# Altium schematic sheet FAT34.SchDoc
size A3
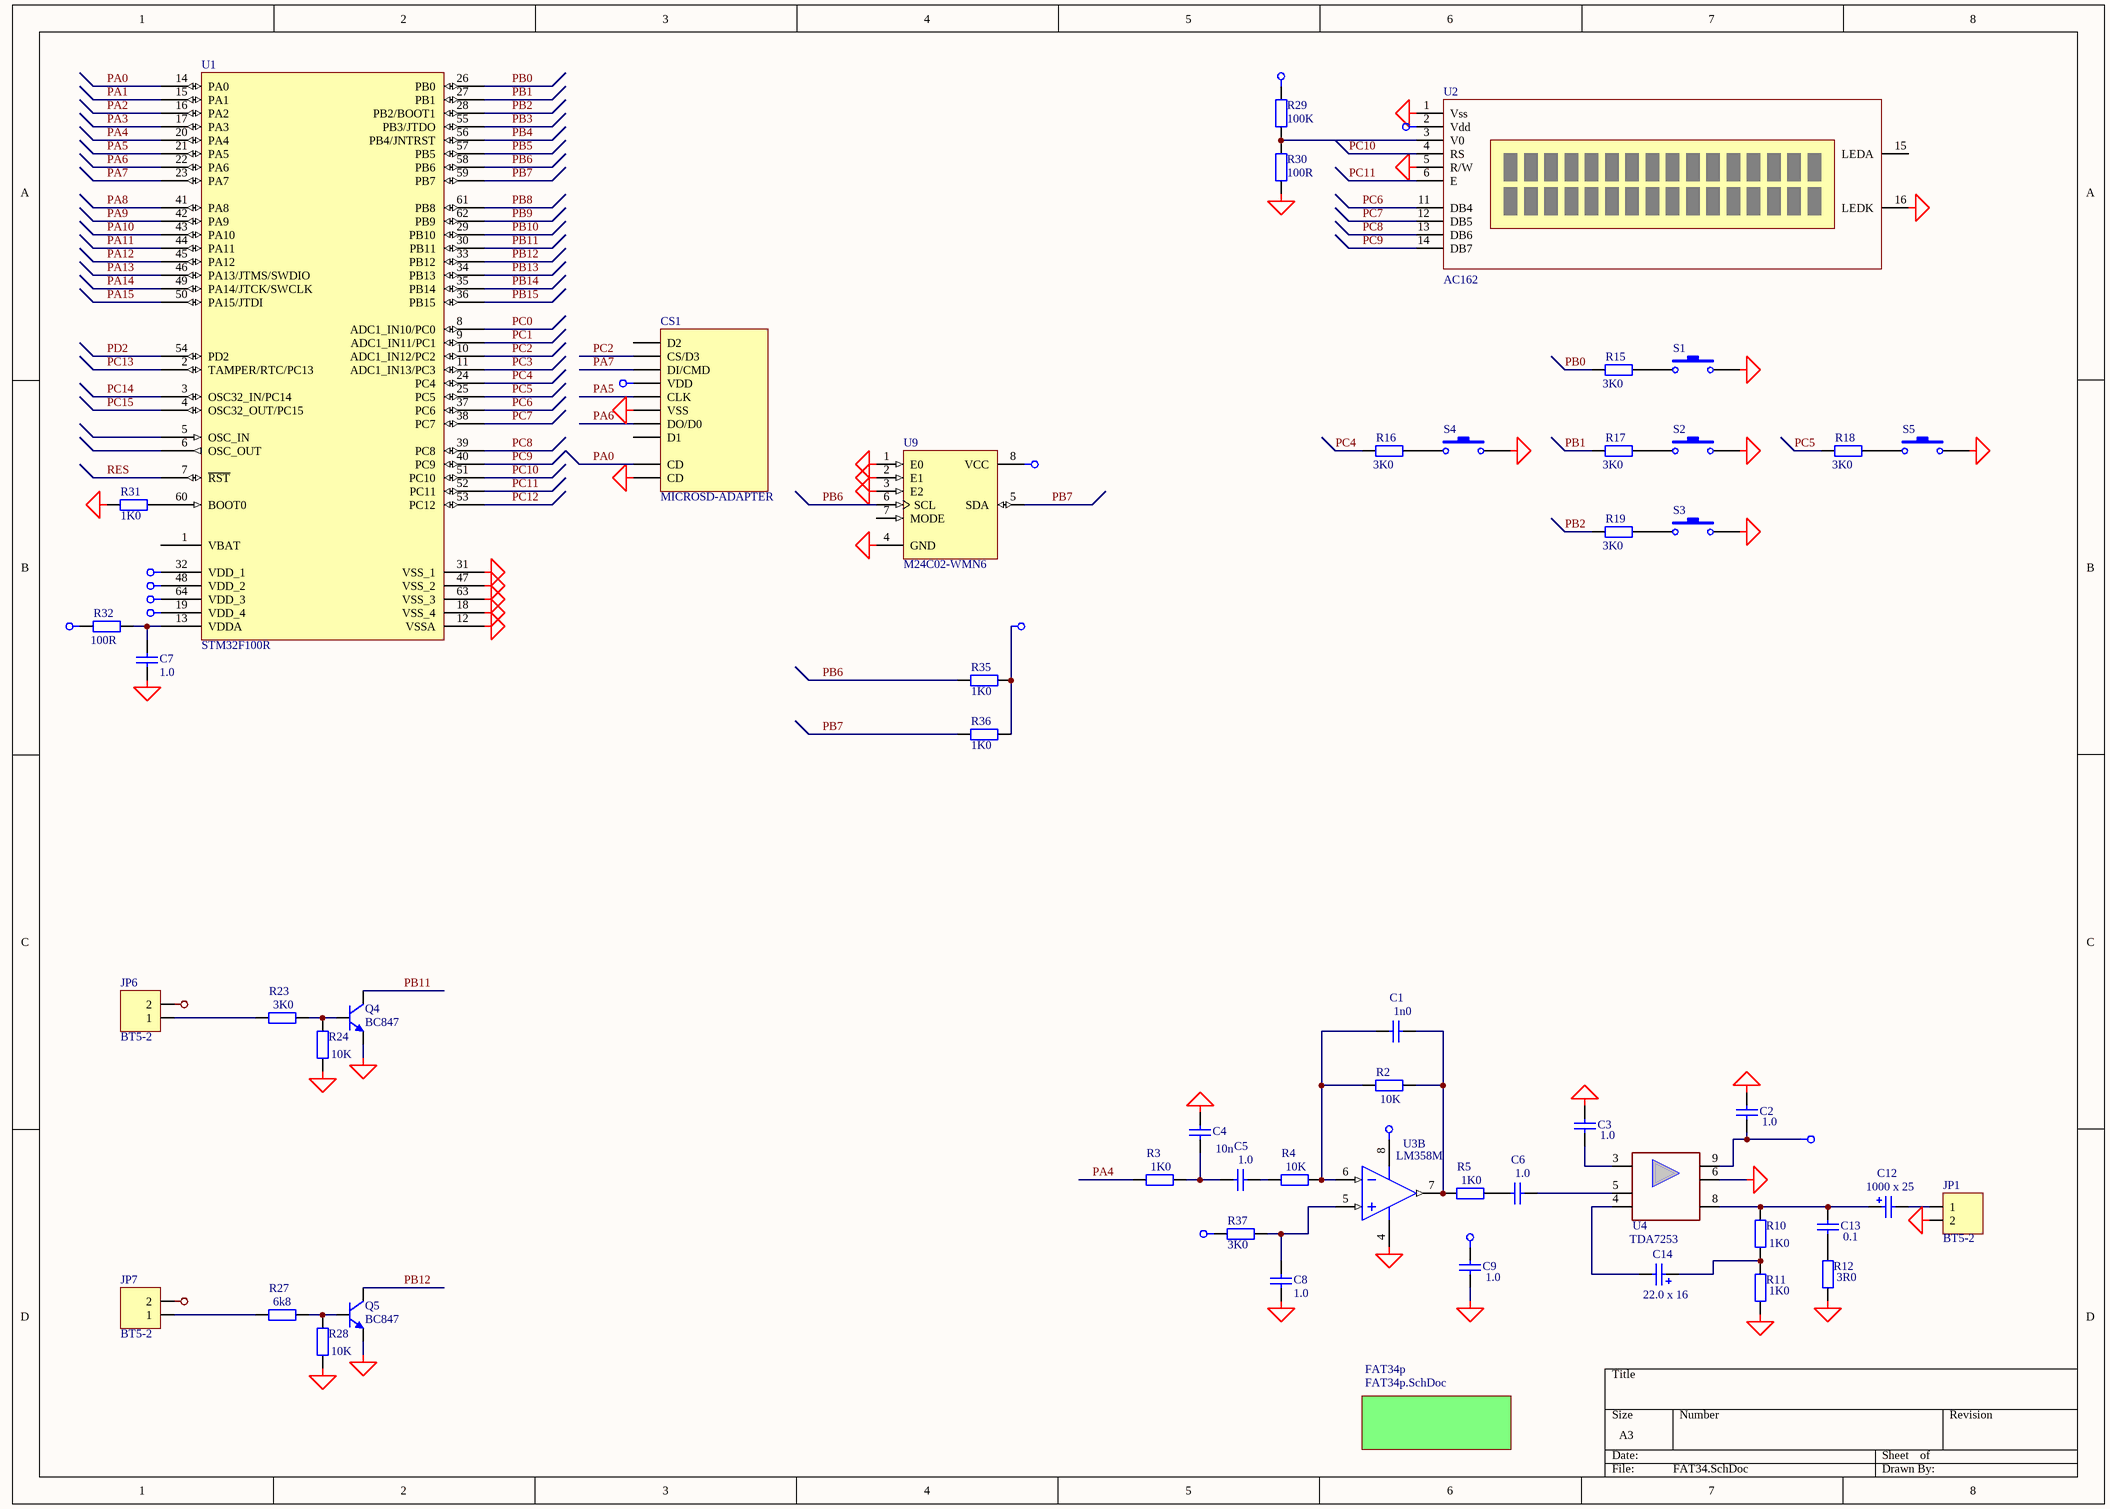
[diagram p0: FAT34.SchDoc]

## Parts
C1  1n0  [_1206]
C2  1.0  [C3216-1206]
C3  1.0  [C3216-1206]
C4  10n  [_1206]
C5  1.0  [_1206]
C6  1.0  [_1206]
C7  1.0  [_1206]
C8  1.0  [_1206]
C9  1.0  [_1206]
C12  1000 x 25  [el5]
C13  0.1  [C3216-1206]
C14  22.0 x 16  [el3]
CS1  MICROSD-ADAPTER  [microSD_1]
JP1  BT5-2  [BT5-2-1]
JP6  BT5-2  [BT5-2-1]
JP7  BT5-2  [BT5-2-1]
Q4  BC847  [SO-G3]
Q5  BC847  [SO-G3]
R2  10K  [_1206]
R3  1K0  [_1206]
R4  10K  [_1206]
R5  1K0  [_1206]
R10  1K0  [_1206]
R11  1K0  [_1206]
R12  3R0  [_1206]
R15  3K0  [_1206]
R16  3K0  [_1206]
R17  3K0  [_1206]
R18  3K0  [_1206]
R19  3K0  [_1206]
R23  3K0  [_1206]
R24  10K  [_1206]
R27  6k8  [_1206]
R28  10K  [_1206]
R29  100K  [_1206]
R30  100R  [_1206]
R31  1K0  [_1206]
R32  100R  [_1206]
R35  1K0  [_1206]
R36  1K0  [_1206]
R37  3K0  [_1206]
S1  SWT-6  [SWT-6-9]  (value not drawn)
S2  SWT-6  [SWT-6-9]  (value not drawn)
S3  SWT-6  [SWT-6-9]  (value not drawn)
S4  SWT-6  [SWT-6-9]  (value not drawn)
S5  SWT-6  [SWT-6-9]  (value not drawn)
U1  STM32F100R  [F-QFP10X10-G64/N]
U2  (no value)  [AC-162A]
U3  LM358M  [SO-G8]  (part B of 2)
U4  TDA7253  [Clipwatt11]
U9  M24C02-WMN6  [SO-G8/E2.9]

## Sub-sheets
FAT34p = FAT34p.SchDoc: no entries

## Nets
+3v3: CS1.4(VDD) R32.2 R35.2 R36.2 R37.2 U1.19(VDD_4) U1.32(VDD_1) U1.48(VDD_2) U1.64(VDD_3) U9.8(VCC)
+5v: JP6.2 R29.2 U2.2(Vdd)
+12v: C2.1 C9.2 JP7.2 U3.8(V+) U4.9
GND: C2.2 C3.2 C4.2 C7.2 C8.2 C9.1 CS1.6(VSS) CS1.10(CD) JP1.2 Q4.2(E) Q5.2(E) R11.1 R12.1 R24.2 R28.2 R30.1 R31.1 S1.2 S2.2 S3.2 S4.2 S5.2 U1.12(VSSA) U1.18(VSS_4) U1.31(VSS_1) U1.47(VSS_2) U1.63(VSS_3) U2.1(Vss) U2.5(R/W) U2.16(LEDK) U3.4(GND) U4.6 U9.1(E0) U9.2(E1) U9.3(E2) U9.4(GND)
PA0: CS1.9(CD) U1.14(PA0)
PA1: U1.15(PA1)
PA2: U1.16(PA2)
PA3: U1.17(PA3)
PA4: R3.2 U1.20(PA4)
PA5: CS1.5(CLK) U1.21(PA5)
PA6: CS1.7(DO/D0) U1.22(PA6)
PA7: CS1.3(DI/CMD) U1.23(PA7)
PA8: U1.41(PA8)
PA9: U1.42(PA9)
PA10: U1.43(PA10)
PA11: U1.44(PA11)
PA12: U1.45(PA12)
PA13: U1.46(PA13/JTMS/SWDIO)
PA14: U1.49(PA14/JTCK/SWCLK)
PA15: U1.50(PA15/JTDI)
PB0: R15.1 U1.26(PB0)
PB1: R17.1 U1.27(PB1)
PB2: R19.1 U1.28(PB2/BOOT1)
PB3: U1.55(PB3/JTDO)
PB4: U1.56(PB4/JNTRST)
PB5: U1.57(PB5)
PB6: R35.1 U1.58(PB6) U9.6(SCL)
PB7: R36.1 U1.59(PB7) U9.5(SDA)
PB8: U1.61(PB8)
PB9: U1.62(PB9)
PB10: U1.29(PB10)
PB11: Q4.3(C) U1.30(PB11)
PB12: Q5.3(C) U1.33(PB12)
PB13: U1.34(PB13)
PB14: U1.35(PB14)
PB15: U1.36(PB15)
PC0: U1.8(ADC1_IN10/PC0)
PC1: U1.9(ADC1_IN11/PC1)
PC2: CS1.2(CS/D3) U1.10(ADC1_IN12/PC2)
PC3: U1.11(ADC1_IN13/PC3)
PC4: R16.1 U1.24(PC4)
PC5: R18.1 U1.25(PC5)
PC6: U1.37(PC6) U2.11(DB4)
PC7: U1.38(PC7) U2.12(DB5)
PC8: U1.39(PC8) U2.13(DB6)
PC9: U1.40(PC9) U2.14(DB7)
PC10: U1.51(PC10) U2.4(RS)
PC11: U1.52(PC11) U2.6(E)
PC12: U1.53(PC12)
PC13: U1.2(TAMPER/RTC/PC13)
PC14: U1.3(OSC32_IN/PC14)
PC15: U1.4(OSC32_OUT/PC15)
PD2: U1.54(PD2)
RES: U1.7(~{RST})
NetC1_1: C1.1 R2.1 R5.1 U3.7(OUT)
NetC1_2: C1.2 R2.2 R4.1 U3.6(IN-)
NetC3_1: C3.1 U4.3(MUTE)
NetC4_1: C4.1 C5.1 R3.1
NetC5_2: C5.2 R4.2
NetC6_1: C6.1 R5.2
NetC6_2: C6.2 U4.5(+)
NetC7_1: C7.1 R32.1 U1.13(VDDA)
NetC8_1: C8.1 R37.1 U3.5(IN+)
NetC12_1: C12.1 C13.2 R10.2 U4.8
NetC12_2: C12.2 JP1.1
NetC13_1: C13.1 R12.2
NetC14_1: C14.1 R10.1 R11.2
NetC14_2: C14.2 U4.4
NetJP6_1: JP6.1 R23.2
NetJP7_1: JP7.1 R27.2
NetQ4_1: Q4.1(B) R23.1 R24.1
NetQ5_1: Q5.1(B) R27.1 R28.1
NetR15_2: R15.2 S1.1
NetR16_2: R16.2 S4.1
NetR17_2: R17.2 S2.1
NetR18_2: R18.2 S5.1
NetR19_2: R19.2 S3.1
NetR29_1: R29.1 R30.2 U2.3(V0)
NetR31_2: R31.2 U1.60(BOOT0)

Not connected (* = marked no-connect by the designer): CS1 1(D2) 8(D1); U1 1(VBAT) 5(OSC_IN) 6(OSC_OUT); U2 15(LEDA); U9 7(MODE)

## Library data of the parts
C1 = Cap Semi: Capacitor (Semiconductor SIM Model); Manufacturer: Generic Components; Class I: Passive; Value: 1000; Published: 8-Jun-2000; Revision: July-2002: Re-released for DXP Platform.; Publisher: Altium Limited; Class II: Capacitor
C2-C4 C7 C8 C13 = Cap Semi: Capacitor (Semiconductor SIM Model); Manufacturer: Generic Components; Class I: Passive; Value: 0,1; Published: 8-Jun-2000; Revision: July-2002: Re-released for DXP Platform.; Publisher: Altium Limited; Class II: Capacitor
C5 C6 = Cap Semi: Capacitor (Semiconductor SIM Model); Manufacturer: Generic Components; Class I: Passive; Published: 8-Jun-2000; Revision: July-2002: Re-released for DXP Platform.; Publisher: Altium Limited; Class II: Capacitor; Value: 1.0
C9 = Cap: Capacitor; Manufacturer: Generic Components; Class I: Passive; Published: 8-Jun-2000; Revision: July-2002: Re-released for DXP Platform.; Publisher: Altium Limited; Class II: Capacitor; Value: 1.0
C12 C14 = Cap Pol1: Polarized Capacitor (Radial); Manufacturer: Generic Components; Class I: Passive; Value: 220,0; Published: 8-Jun-2000; Revision: July-2002: Re-released for DXP Platform.; Publisher: Altium Limited; Class II: Capacitor
JP1 JP6 JP7 = BT5-2: Header, 3-Pin; Manufacturer: Generic Components; Class I: Connector; Revision: July-2002: Re-released for DXP Platform.; Publisher: Altium Limited
Q4 Q5 = BC847ALT1: General Purpose Transistor NPN Silicon; Manufacturer: Motorola; Package Information: Latest Revision: 1997; Class I: Discrete; Class II: BJT - Low Power; Published: 29-Sep-2000; Revision: July-2002: Re-released for DXP Platform.; Datasheet: Latest Revision: 1997; Package Reference: 318-08; Publisher: Altium Limited
R2 = Res2: Resistor; Manufacturer: Generic Components; Class I: Passive; Value: 33K; Published: 8-Jun-2000; Revision: July-2002: Re-released for DXP Platform.; Publisher: Altium Limited; Class II: Resistor
R3 R5 R23 R27 R32 R37 = Res2: Resistor; Manufacturer: Generic Components; Class I: Passive; Value: 1K; Published: 8-Jun-2000; Revision: July-2002: Re-released for DXP Platform.; Publisher: Altium Limited; Class II: Resistor
R4 R24 R28 = Res2: Resistor; Manufacturer: Generic Components; Class I: Passive; Published: 8-Jun-2000; Revision: July-2002: Re-released for DXP Platform.; Publisher: Altium Limited; Class II: Resistor; Value: 10K
R10-R12 R15-R19 R29-R31 R35 R36 = RES: Resistor; Manufacturer: Generic Components; Class I: Passive; Value: 1K; Published: 8-Jun-2000; Revision: July-2002: Re-released for DXP Platform.; Publisher: Altium Limited; Class II: Resistor
S1-S5 = SWT-6: Switch; Manufacturer: Generic Components; Published: 24-Mar-1999; Revision: July-2002: Re-released for DXP Platform.; Publisher: Altium Limited
U1 = STM32F100R: STM32 ARM-based 32-bit MCU with 64 Kbytes Flash, 64-pin LQFP, Industrial Temperature; Published: *; DatasheetVersion: *; PackageVersion: *; PackageReference: *; Publisher: *; PackageDescription: *; ComponentLink1Description: *; ComponentLink1URL: *; ComponentLink2Description: *; ComponentLink2URL: *
U2 = AC-162A
U3 = LM358M: Low-Power Dual Operational Amplifier; Manufacturer: National Semiconductor; Package Information: Latest Revision: Sep-1997; Published: 15-Apr-2002; Datasheet: Latest Revision: Sep-1999; Package Reference: M08A; Publisher: Altium Limited; Class I: Amplifier; Class II: Operational Amplifier
U9 = ST24C01M6: Serial 1K (128 x 8) EEPROM; Manufacturer: ST-Microelectronics; Package Information: Latest Revision: Jul-1999; Class I: Memory; Published: 24-Aug-2001; Revision: July-2002: Re-released for DXP Platform.; Datasheet: Latest Revision: Nov-1997; Package Reference: SOP8; Publisher: Altium Limited; Class II: EEPROM